# Altium project IMUCubeSL.PrjPCB
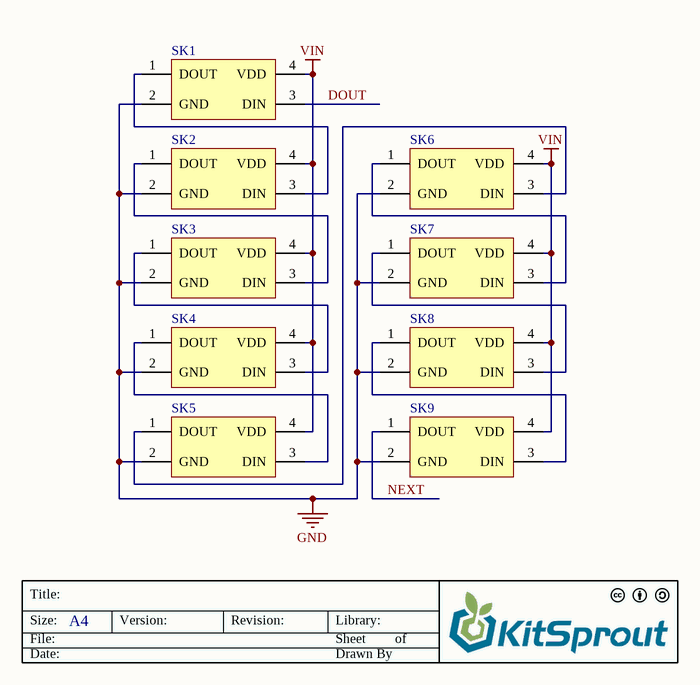
[diagram p0: IMUCubeSL_Sch.SchDoc]
1 sheet, 9 parts. Net scope: global (net labels, ports and power ports of the same name join across sheets).
Board files: IMUCubeSL_A_Pcb.PcbDoc, IMUCubeSL_B_Pcb.PcbDoc, IMUCubeSL_C_Pcb.PcbDoc, IMUCubeSL_D_Pcb.PcbDoc, IMUCubeSL_E_Pcb.PcbDoc

## Sheet IMUCubeSL_Sch.SchDoc: IMUCube-SL
size A4; Author: Hom; CompanyName: KitSprout; DrawnBy: Hom; Engineer: Hom; Organization: KitSprout; Revision: A; SheetNumber: 1; SheetTotal: 1; Version: 1.2; LibVersion: 2.3

### Parts
SK1  LED_3535_SK6812  [LED_3535_4P]  (value not drawn)
SK2  LED_3535_SK6812  [LED_3535_4P]  (value not drawn)
SK3  LED_3535_SK6812  [LED_3535_4P]  (value not drawn)
SK4  LED_3535_SK6812  [LED_3535_4P]  (value not drawn)
SK5  LED_3535_SK6812  [LED_3535_4P]  (value not drawn)
SK6  LED_3535_SK6812  [LED_3535_4P]  (value not drawn)
SK7  LED_3535_SK6812  [LED_3535_4P]  (value not drawn)
SK8  LED_3535_SK6812  [LED_3535_4P]  (value not drawn)
SK9  LED_3535_SK6812  [LED_3535_4P]  (value not drawn)

### Nets
GND: SK1.2(GND) SK2.2(GND) SK3.2(GND) SK4.2(GND) SK5.2(GND) SK6.2(GND) SK7.2(GND) SK8.2(GND) SK9.2(GND)
VIN: SK1.4(VDD) SK2.4(VDD) SK3.4(VDD) SK4.4(VDD) SK5.4(VDD) SK6.4(VDD) SK7.4(VDD) SK8.4(VDD) SK9.4(VDD)
DOUT: SK1.3(DIN)
NEXT: SK9.1(DOUT)
NetSK1_1: SK1.1(DOUT) SK2.3(DIN)
NetSK2_1: SK2.1(DOUT) SK3.3(DIN)
NetSK3_1: SK3.1(DOUT) SK4.3(DIN)
NetSK4_1: SK4.1(DOUT) SK5.3(DIN)
NetSK5_1: SK5.1(DOUT) SK6.3(DIN)
NetSK6_1: SK6.1(DOUT) SK7.3(DIN)
NetSK7_1: SK7.1(DOUT) SK8.3(DIN)
NetSK8_1: SK8.1(DOUT) SK9.3(DIN)

### Notes on the sheet
- Title:
- Size:
- Date:
- File:
- A4
- Version:
- Revision:
- Sheet
- Drawn By
- Library:
- of

### Library data of the parts
SK1-SK9 = LED_3535_SK6812: LED